# Altium schematic sheet USB.SchDoc
size A4; Author: Nguyễn Hữu Thắng; DrawnBy: Nguyễn Hữu Thắng; SheetNumber: 28; SheetTotal: 36
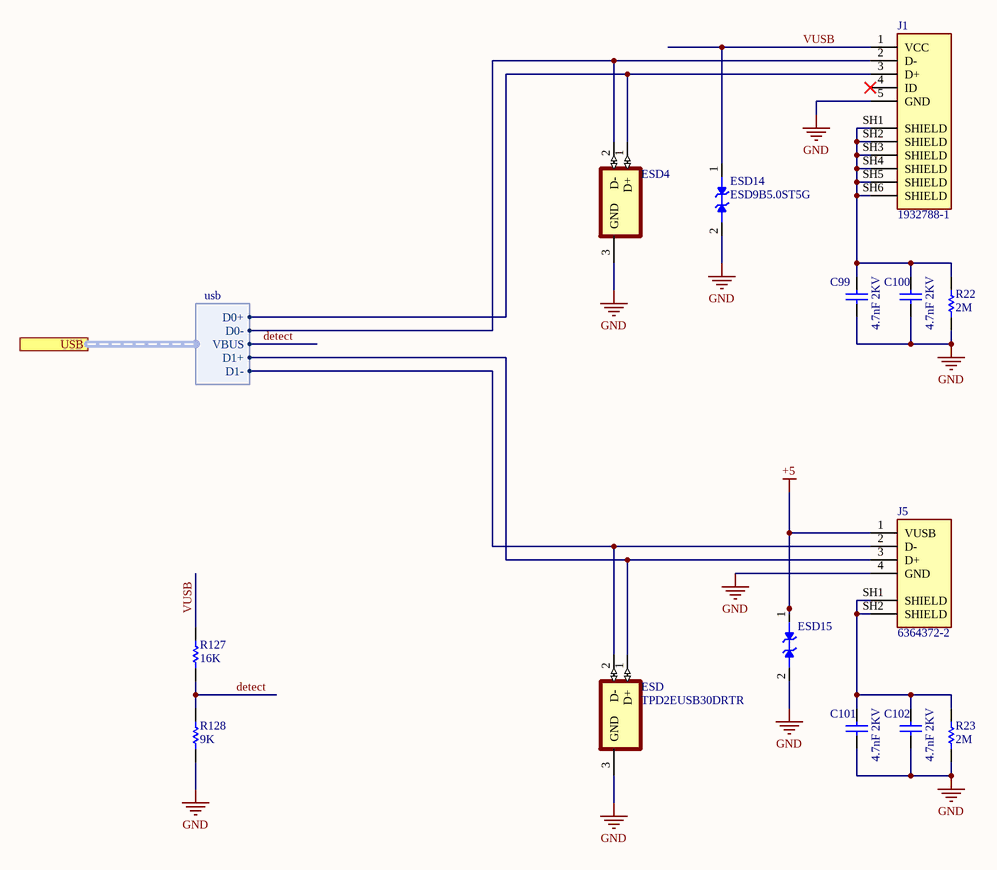
[diagram p0: USB.SchDoc]

## Parts
C99  value 4.7nF 2KV  [C1210]  (hidden comment: C1210)
C100  value 4.7nF 2KV  [C1210]  (hidden comment: C1210)
C101  value 4.7nF 2KV  [C1210]  (hidden comment: C1210)
C102  value 4.7nF 2KV  [C1210]  (hidden comment: C1210)
ESD  TPD2EUSB30DRTR  [SOTFL35P100X50-3N]
ESD4  TPD2EUSB30DRTR  [SOTFL35P100X50-3N]  (value not drawn)
ESD14  ESD9B5.0ST5G  [SODFL1006X40N]
ESD15  ESD9B5.0ST5G  [SODFL1006X40N]  (value not drawn)
J1  1932788-1  [TE_1932788-1]
J5  6364372-2  [TE_6364372-2]
R22  value 2M  [R0603]  (hidden comment: R0603)
R23  value 2M  [R0603]  (hidden comment: R0603)
R127  value 16K  [R0603]  (hidden comment: R0603)
R128  value 9K  [R0603]  (hidden comment: R0603)

## Ports
USB (harness usb, see main[9000,4700], MT8365[6600,9000], MT8365_CONN[2500,5900])

## Harnesses
usb: D0+, D0-, D1+, D1-, VBUS

## Nets
+5: ESD15.1(A) J5.1(VUSB)
GND: C99.1 C100.1 C101.1 C102.1 ESD.3(GND) ESD4.3(GND) ESD14.2(A1) ESD15.2(A1) J1.5(GND) J5.4(GND) R22.2 R23.2 R128.1
detect: R127.1 R128.2 ; port USB.VBUS
VUSB: ESD14.1(A) J1.1(VCC) R127.2
NetC99_2: C99.2 C100.2 J1.SH1(SHIELD) J1.SH2(SHIELD) J1.SH3(SHIELD) J1.SH4(SHIELD) J1.SH5(SHIELD) J1.SH6(SHIELD) R22.1
NetC101_2: C101.2 C102.2 J5.SH1(SHIELD) J5.SH2(SHIELD) R23.1
NetESD4_1: ESD4.1(D+) J1.3(D+) ; port USB.D0+
NetESD4_2: ESD4.2(D-) J1.2(D-) ; port USB.D0-
NetESD_1: ESD.1(D+) J5.3(D+) ; port USB.D1+
NetESD_2: ESD.2(D-) J5.2(D-) ; port USB.D1-

Not connected (* = marked no-connect by the designer): J1 4(ID)*

## Library data of the parts
ESD ESD4 = TPD2EUSB30DRTR: 2-channel ESD solution for SuperSpeed USB 3.0 interface 3-SOT-9X3 -40 to 85
ESD14 ESD15 = ESD9B5.0ST5G: Clamp Ipp Tvs Diode Surface Mount SOD-923